# Altium project AVCI_Mk1.PrjPcb (part 3 of 3)
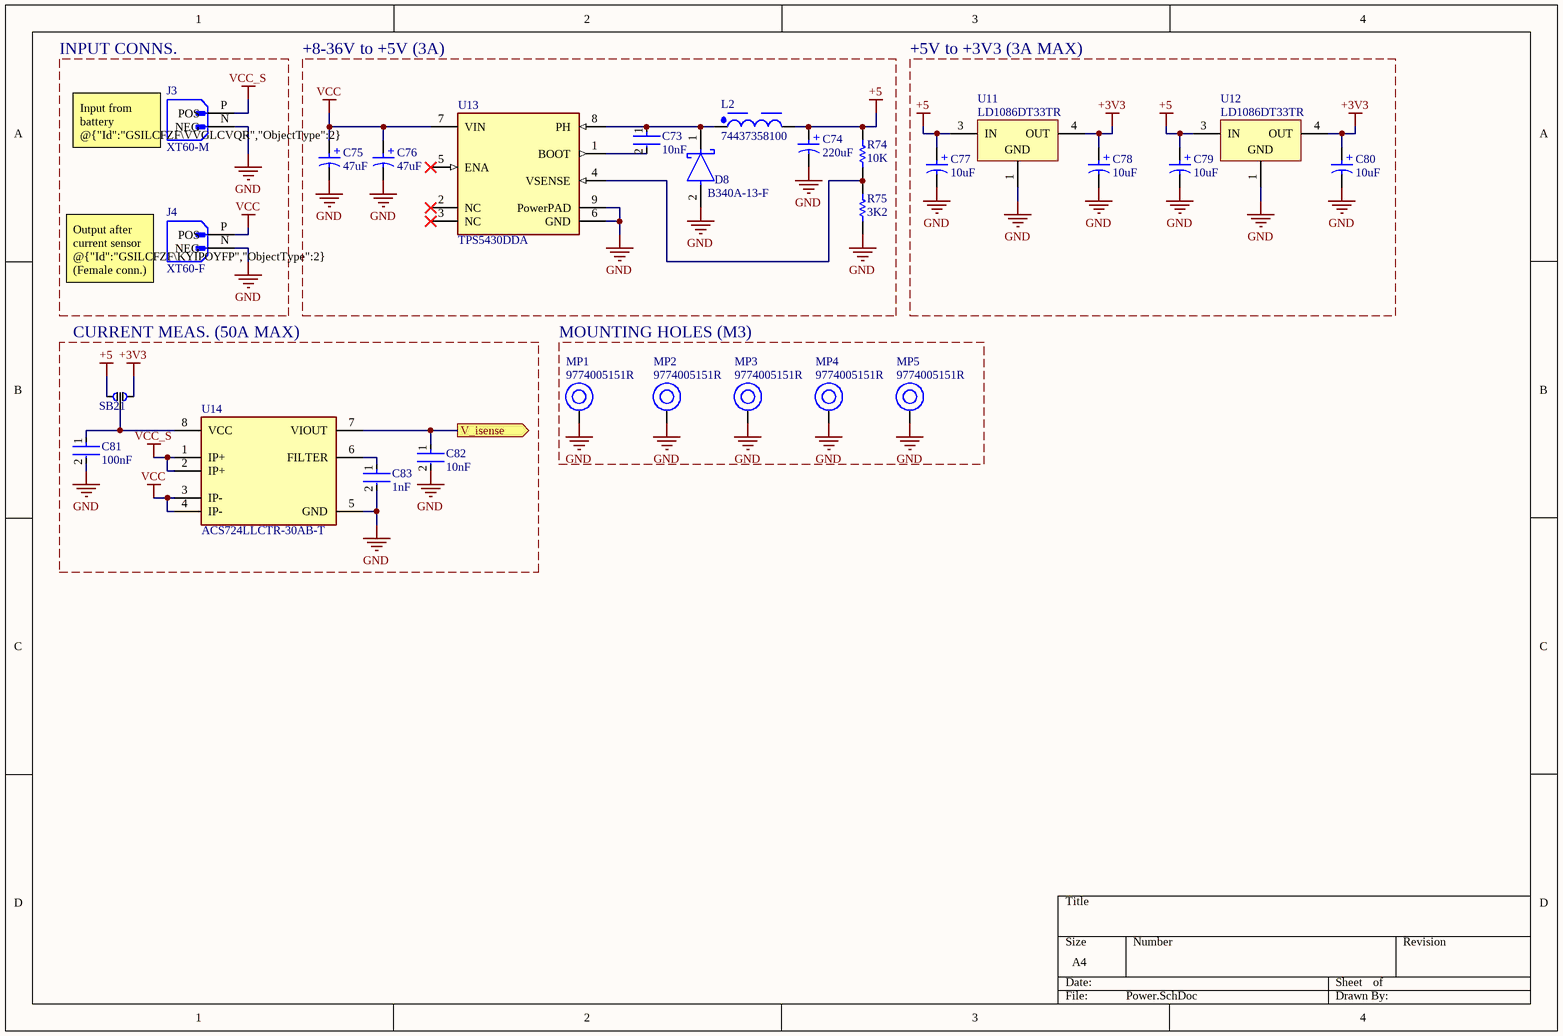
[diagram p8: Power.SchDoc]

## Nets that join several sheets
+3V3: FCC_Connectors (C70.1 C71.1 P9.1 P12.1), FCC_Peripherals (16 pins), NAVC_MCU (47 pins), NAVC_Peripherals (30 pins), NAVC_Connectors (18 pins), FCC_MCU (21 pins), Power (5 pins)
+5: FCC_Connectors (18 pins), FCC_Peripherals (10 pins), NAVC_Connectors (SB9.1), Power (8 pins)
GND: FCC_Connectors (22 pins), FCC_Peripherals (23 pins), NAVC_MCU (50 pins), NAVC_Peripherals (41 pins), NAVC_Connectors (19 pins), FCC_MCU (29 pins), Power (24 pins)
NetC5_1: NAVC_MCU (C5.1 SW2.1 U1.31), NAVC_Connectors (P1.4)
NetC54_1: FCC_Connectors (P9.4), FCC_MCU (C54.1 SW5.1 U7.14)
NetC82_1: NAVC_MCU (R2.1), Power (C82.1 U14.7)
NetJ2_2: NAVC_MCU (R5.1), NAVC_Connectors (J2.2 R44.1)
NetJ2_3: NAVC_MCU (R5.4), NAVC_Connectors (J2.3)
NetJ2_5: NAVC_MCU (R5.2), NAVC_Connectors (J2.5)
NetJ2_7: NAVC_MCU (R5.3), NAVC_Connectors (J2.7)
NetMD1_2: NAVC_MCU (R23.1 U1.169), NAVC_Peripherals (MD1.2)
NetMD1_3: NAVC_MCU (R22.1 U1.170), NAVC_Peripherals (MD1.3)
NetMD1_16: NAVC_MCU (R27.1 U1.16), NAVC_Peripherals (MD1.16 U5.5)
NetMD1_17: NAVC_MCU (R26.1 U1.17), NAVC_Peripherals (MD1.17 U5.6)
NetP1_2: NAVC_MCU (U1.137), NAVC_Connectors (P1.2)
NetP1_3: NAVC_MCU (U1.124), NAVC_Connectors (P1.3)
NetP2_2: NAVC_MCU (R6.1), NAVC_Connectors (P2.2)
NetP2_3: NAVC_MCU (R7.1), NAVC_Connectors (P2.3)
NetP2_4: NAVC_MCU (R8.1), NAVC_Connectors (P2.4)
NetP2_5: NAVC_MCU (R13.1), NAVC_Connectors (P2.5)
NetP2_6: NAVC_MCU (R13.2), NAVC_Connectors (P2.6)
NetP2_7: NAVC_MCU (R13.3), NAVC_Connectors (P2.7)
NetP2_8: NAVC_MCU (R13.4), NAVC_Connectors (P2.8)
NetP3_2: NAVC_MCU (R28.1 U1.84), NAVC_Connectors (P3.2)
NetP3_3: NAVC_MCU (R29.1 U1.85), NAVC_Connectors (P3.3)
NetP4_2: NAVC_MCU (R20.1 U1.79), NAVC_Connectors (P4.2)
NetP4_3: NAVC_MCU (R21.1 U1.80), NAVC_Connectors (P4.3)
NetP4_4: NAVC_MCU (R30.2 U1.93), NAVC_Connectors (P4.4)
NetP4_5: NAVC_MCU (U1.94), NAVC_Connectors (P4.5)
NetP5_2: NAVC_MCU (R14.1), NAVC_Connectors (P5.2)
NetP5_3: NAVC_MCU (R14.2), NAVC_Connectors (P5.3)
NetP5_4: NAVC_MCU (R14.3), NAVC_Connectors (P5.4)
NetP5_5: NAVC_MCU (R14.4), NAVC_Connectors (P5.5)
NetP6_2: NAVC_Peripherals (R42.2 U6.6), NAVC_Connectors (P6.2)
NetP6_3: NAVC_Peripherals (SB8.2 U6.7), NAVC_Connectors (P6.3)
NetP7_2: NAVC_MCU (R16.2), NAVC_Connectors (P7.2)
NetP7_3: NAVC_MCU (R16.3), NAVC_Connectors (P7.3)
NetP7_4: NAVC_MCU (R16.4), NAVC_Connectors (P7.4)
NetP7_5: NAVC_MCU (R16.1), NAVC_Connectors (P7.5)
NetP8_2: NAVC_MCU (R3.1), NAVC_Connectors (P8.2)
NetP8_3: NAVC_MCU (R4.1), NAVC_Connectors (P8.3)
NetP9_2: FCC_Connectors (P9.2), FCC_MCU (U7.76)
NetP9_3: FCC_Connectors (P9.3), FCC_MCU (U7.72)
NetP11_1: FCC_Connectors (P11.1), FCC_Peripherals (U9.6)
NetP11_2: FCC_Connectors (P11.2), FCC_Peripherals (U9.7)
NetP11_3: FCC_Connectors (P11.3), FCC_Peripherals (U9.8)
NetP11_4: FCC_Connectors (P11.4), FCC_Peripherals (U9.9)
NetP11_5: FCC_Connectors (P11.5), FCC_Peripherals (U9.10)
NetP11_6: FCC_Connectors (P11.6), FCC_Peripherals (U9.11)
NetP11_7: FCC_Connectors (P11.7), FCC_Peripherals (U9.12)
NetP11_8: FCC_Connectors (P11.8), FCC_Peripherals (U9.13)
NetP11_9: FCC_Connectors (P11.9), FCC_Peripherals (U9.15)
NetP11_10: FCC_Connectors (P11.10), FCC_Peripherals (U9.16)
NetP11_11: FCC_Connectors (P11.11), FCC_Peripherals (U9.17)
NetP11_12: FCC_Connectors (P11.12), FCC_Peripherals (U9.18)
NetP11_13: FCC_Connectors (P11.13), FCC_Peripherals (U9.19)
NetP11_14: FCC_Connectors (P11.14), FCC_Peripherals (U9.20)
NetP11_15: FCC_Connectors (P11.15), FCC_Peripherals (U9.21)
NetP11_16: FCC_Connectors (P11.16), FCC_Peripherals (U9.22)
NetP12_2: FCC_Connectors (P12.2), FCC_MCU (R45.5)
NetP12_3: FCC_Connectors (P12.3), FCC_MCU (R45.6)
NetP12_4: FCC_Connectors (P12.4), FCC_MCU (R45.7)
NetP12_5: FCC_Connectors (P12.5), FCC_MCU (R45.8)
NetQ2_2: FCC_Peripherals (Q2.2 R59.1), FCC_MCU (U7.92)
NetQ3_2: FCC_Peripherals (Q3.2 R62.1), FCC_MCU (U7.93)
NetR1_5: NAVC_MCU (R1.5), NAVC_Peripherals (U3.7)
NetR1_6: NAVC_MCU (R1.6), NAVC_Peripherals (U2.4)
NetR1_7: NAVC_MCU (R1.7), NAVC_Peripherals (U2.9)
NetR1_8: NAVC_MCU (R1.8), NAVC_Peripherals (U4.7)
NetR9_1: NAVC_MCU (R9.1), NAVC_Peripherals (U6.4)
NetR10_1: NAVC_MCU (R10.1), NAVC_Peripherals (U6.1)
NetR24_1: NAVC_MCU (R24.1 U1.164), NAVC_Peripherals (U2.13 U4.2)
NetR25_1: NAVC_MCU (R25.1 U1.165), NAVC_Peripherals (U2.14 U4.4)
NetR46_1: NAVC_MCU (U1.138), FCC_MCU (R46.1)
NetR46_2: NAVC_MCU (U1.139), FCC_MCU (R46.2)
NetR46_3: NAVC_MCU (U1.140), FCC_MCU (R46.3)
NetR46_4: NAVC_MCU (U1.141), FCC_MCU (R46.4)
NetR48_1: FCC_Peripherals (U8.4), FCC_MCU (R48.1)
NetR49_1: FCC_Peripherals (U8.9), FCC_MCU (R49.1)
NetR51_1: FCC_Peripherals (U10.6), FCC_MCU (R51.1 U7.47)
NetR52_1: FCC_Peripherals (U10.5), FCC_MCU (R52.1 U7.48)
NetR53_1: FCC_Peripherals (U8.13), FCC_MCU (R53.1 U7.67)
NetR54_1: FCC_Peripherals (U8.14), FCC_MCU (R54.1 U7.66)

## Assembly variants
Only Populated Parts: not fitted C?